# Altium schematic sheet 2_BLE.SchDoc: SmartHalo - Radio
size B; Author: Sébastien Gélinas; Organization: SmartHalo; Address1: 5445 de Gaspé; Address2: Montréal, QC; Address3: Canada; Address4: H2T 3B2; DocumentNumber: 4; Revision: 1; SheetNumber: 2; SheetTotal: 7
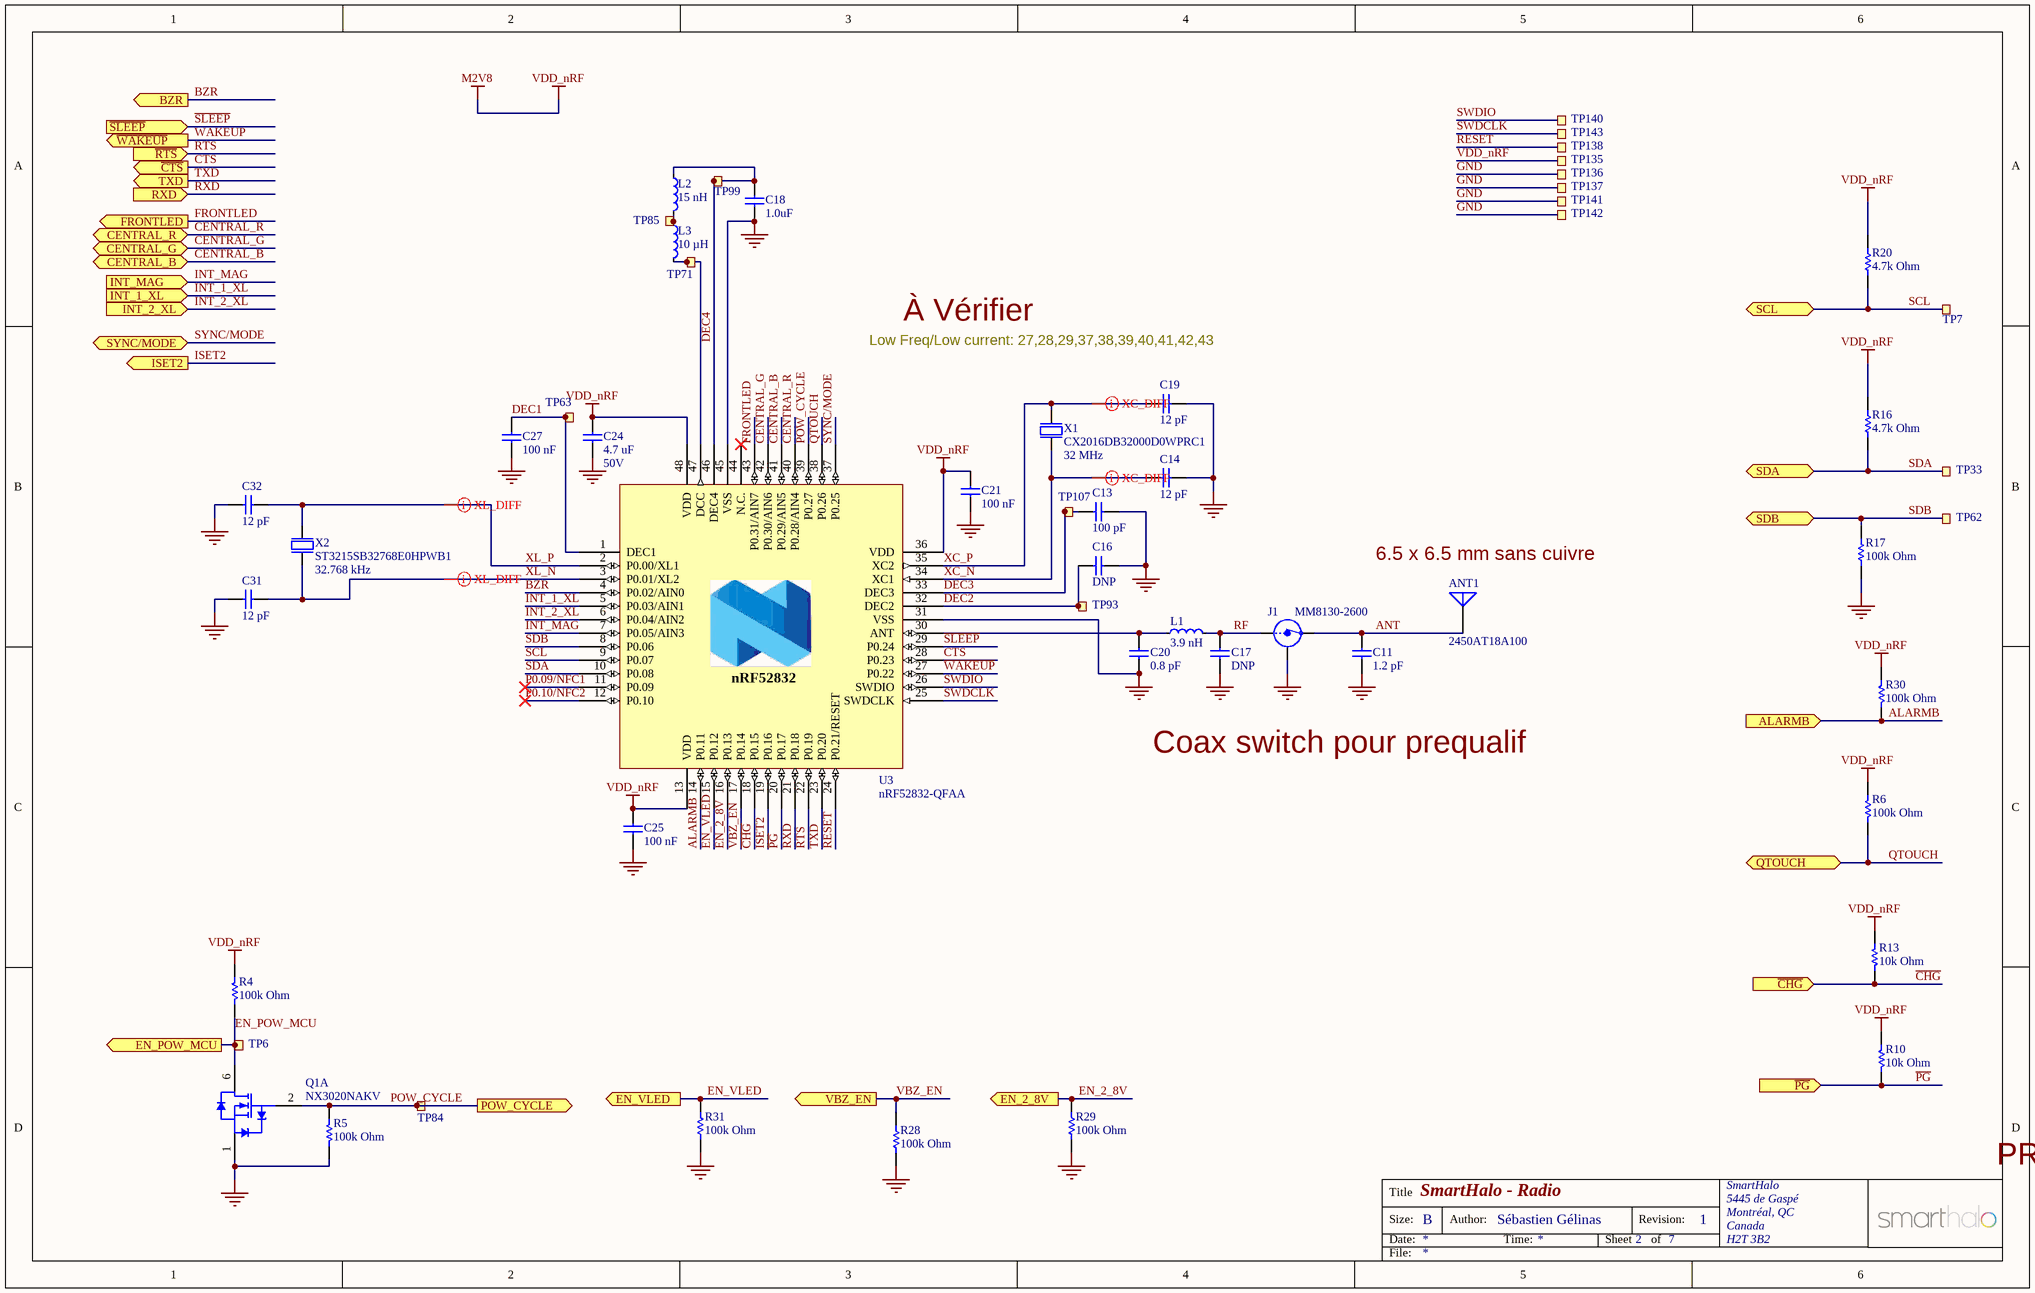
[diagram p0: 2_BLE.SchDoc]

## Parts
ANT1  2450AT18A100  [2450AT18A100]
C11  1.2 pF  [Varitron_CAP0402]
C13  100 pF  [Varitron_CAP0402]
C14  12 pF  [Varitron_CAP0402]
C16  DNP  [Varitron_CAP0402]  (no BOM)
C17  DNP  [Varitron_CAP0402]  (no BOM)
C18  1.0uF  [Varitron_CAP0603]
C19  12 pF  [Varitron_CAP0402]
C20  0.8 pF  [Varitron_CAP0402]
C21  100 nF  [Varitron_CAP0402]
C24  4.7 uF  Voltage Rating: 50V  [Varitron_CAP0805]
C25  100 nF  [Varitron_CAP0402]
C27  100 nF  [Varitron_CAP0402]
C31  12 pF  [Varitron_CAP0402]
C32  12 pF  [Varitron_CAP0402]
J1  MM8130-2600  [COAXIAL-SWF]
L1  3.9 nH  [Varitron_IND0402]
L2  15 nH  [Varitron_IND0402]
L3  10 µH  [Varitron_IND0603]
Q1  NX3020NAKV  [SOT666]  (part A of 2)
R4  100k Ohm  [Varitron_RES0402]
R5  100k Ohm  [Varitron_RES0402]
R6  100k Ohm  [Varitron_RES0402]
R10  10k Ohm  [Varitron_RES0402]
R13  10k Ohm  [Varitron_RES0402]
R16  4.7k Ohm  [Varitron_RES0402]
R17  100k Ohm  [Varitron_RES0402]
R20  4.7k Ohm  [Varitron_RES0402]
R28  100k Ohm  [Varitron_RES0402]
R29  100k Ohm  [Varitron_RES0402]
R30  100k Ohm  [Varitron_RES0402]
R31  100k Ohm  [Varitron_RES0402]
TP6  (no value)  [TESTPAD-TH-35mils]  (no BOM)
TP7  (no value)  [TESTPAD-TH-35mils]  (no BOM)
TP33  (no value)  [TESTPAD-TH-35mils]  (no BOM)
TP62  (no value)  [TESTPAD-TH-35mils]  (no BOM)
TP63  (no value)  [TESTPAD-TH-35mils]  (no BOM)
TP71  (no value)  [TESTPAD-TH-35mils]  (no BOM)
TP84  (no value)  [TESTPAD-TH-35mils]  (no BOM)
TP85  (no value)  [TESTPAD-TH-35mils]  (no BOM)
TP93  (no value)  [TESTPAD-TH-35mils]  (no BOM)
TP99  (no value)  [TESTPAD-TH-35mils]  (no BOM)
TP107  (no value)  [TESTPAD-TH-35mils]  (no BOM)
TP135  (no value)  [TESTPAD-TH-1_5mm]  (no BOM)
TP136  (no value)  [TESTPAD-TH-1_5mm]  (no BOM)
TP137  (no value)  [TESTPAD-TH-1_5mm]  (no BOM)
TP138  (no value)  [TESTPAD-TH-1_5mm]  (no BOM)
TP140  (no value)  [TESTPAD-TH-1_5mm]  (no BOM)
TP141  (no value)  [TESTPAD-TH-1_5mm]  (no BOM)
TP142  (no value)  [TESTPAD-TH-1_5mm]  (no BOM)
TP143  (no value)  [TESTPAD-TH-1_5mm]  (no BOM)
U3  nRF52832-QFAA  [QFN40P600X600X90-48N]
X1  CX2016DB32000D0WPRC1  Frequency: 32 MHz  [CRYSTAL_2016_4Pins]
X2  ST3215SB32768E0HPWB1  Frequency: 32.768 kHz  [CRYSTAL_3215_2Pins]

## Ports
ALARMB (in), BZR (out), CENTRAL_B, CENTRAL_G, CENTRAL_R, EN_2_8V (out), EN_POW_MCU (out), EN_VLED (out), FRONTLED (out), INT_1_XL (in), INT_2_XL (in), INT_MAG (in), ISET2 (out), POW_CYCLE (out), QTOUCH, RXD (in), SCL (bidir), SDA (bidir), SDB (bidir), SYNC/MODE, TXD (out), VBZ_EN (out), ~{CHG} (in), ~{CTS} (out), ~{PG} (in), ~{RTS} (in), ~{SLEEP} (in), ~{WAKEUP} (out)

## Nets
GND: C11.1 C13.2 C14.2 C16.2 C17.1 C18.2 C19.2 C20.1 C21.2 C24.2 C25.2 C27.2 C31.1 C32.1 J1.2(Shield) Q1.1(S1) R5.1 R17.1 R28.2 R29.1 R31.1 TP136.1 TP137.1 TP141.1 TP142.1 U3.31(VSS) U3.45(VSS) U3.49(GND) X1.2(GND) X1.4(GND)
VDD_nRF: C21.1 C24.1 C25.1 R4.2 R6.2 R10.2 R13.1 R16.2 R20.2 R30.2 TP135.1 U3.13(VDD) U3.36(VDD) U3.48(VDD)  [also labelled M2V8]
ALARMB: R30.1 U3.14(P0.11) ; port ALARMB
ANT: ANT1.1(Feed) C11.2 J1.3(OUT)
BZR: U3.4(P0.02/AIN0) ; port BZR
~{CHG}: R13.2 U3.18(P0.15) ; port ~{CHG}
CENTRAL_B: U3.41(P0.29/AIN5) ; port CENTRAL_B
CENTRAL_G: U3.42(P0.30/AIN6) ; port CENTRAL_G
CENTRAL_R: U3.40(P0.28/AIN4) ; port CENTRAL_R
CTS: U3.28(P0.23) ; port ~{CTS}
DEC1: C27.1 TP63.1 U3.1(DEC1)
DEC2: C16.1 TP93.1 U3.32(DEC2)
DEC3: C13.1 TP107.1 U3.33(DEC3)
DEC4: C18.1 L2.1 TP99.1 U3.46(DEC4)
EN_2_8V: R29.2 U3.16(P0.13) ; port EN_2_8V
EN_POW_MCU: Q1.6(D1) R4.1 TP6.1 ; port EN_POW_MCU
EN_VLED: R31.2 U3.15(P0.12) ; port EN_VLED
FRONTLED: U3.43(P0.31/AIN7) ; port FRONTLED
INT_1_XL: U3.5(P0.03/AIN1) ; port INT_1_XL
INT_2_XL: U3.6(P0.04/AIN2) ; port INT_2_XL
INT_MAG: U3.7(P0.05/AIN3) ; port INT_MAG
ISET2: U3.19(P0.16) ; port ISET2
P0.09/NFC1: U3.11(P0.09)
P0.10/NFC2: U3.12(P0.10)
~{PG}: R10.1 U3.20(P0.17) ; port ~{PG}
POW_CYCLE: Q1.2(G1) R5.2 TP84.1 U3.39(P0.27) ; port POW_CYCLE
QTOUCH: R6.1 U3.38(P0.26) ; port QTOUCH
RESET: TP138.1 U3.24(P0.21/RESET)
RF: C17.2 J1.1(IN) L1.2
RTS: U3.22(P0.19) ; port ~{RTS}
RXD: U3.21(P0.18) ; port RXD
~{SLEEP}: U3.29(P0.24) ; port ~{SLEEP}
SCL: R20.1 TP7.1 U3.9(P0.07) ; port SCL
SDA: R16.1 TP33.1 U3.10(P0.08) ; port SDA
SDB: R17.2 TP62.1 U3.8(P0.06) ; port SDB
SWDCLK: TP143.1 U3.25(SWDCLK)
SWDIO: TP140.1 U3.26(SWDIO)
SYNC/MODE: U3.37(P0.25) ; port SYNC/MODE
TXD: U3.23(P0.20) ; port TXD
VBZ_EN: R28.1 U3.17(P0.14) ; port VBZ_EN
~{WAKEUP}: U3.27(P0.22) ; port ~{WAKEUP}
XC_N: C14.1 U3.34(XC1) X1.3(out)
XC_P: C19.1 U3.35(XC2) X1.1(inp)
XL_N: C31.2 U3.3(P0.01/XL2) X2.2
XL_P: C32.2 U3.2(P0.00/XL1) X2.1
NetC20_2: C20.2 L1.1 U3.30(ANT)
NetL2_2: L2.2 L3.1 TP85.1
NetL3_2: L3.2 TP71.1 U3.47(DCC)

Not connected (* = marked no-connect by the designer): U3 44(N.C.)*

## Layout directives
differential pair: XC_N, XC_P, XL_N, XL_P

## Notes on the sheet
- Low Freq/Low current: 27,28,29,37,38,39,40,41,42,43
- À Vérifier
- (near ANT1) 6.5 x 6.5 mm sans cuivre
- Coax switch pour prequalif
- PRELIMINARY: DO NOT USE FOR PRODUCTION
- Title
- Size:
- Date:
- B
- Author:
- Time:
- Sheet
- Revision:
- of
- File:
- (in symbol nRF52832-QFAA) nRF52832

## Library data of the parts
ANT1 = 2450AT18A100: CHIP ANTENNA, 2.45GHz, 3.2 x 1.6 x 1.3 mm body; Manufacturer: Johanson Technology; Part Number: 2450AT18A100; Manufacturer Part Number: 2450AT18A100
C11 = Varitron_CAP0402: 1.2 pF 50V NP0 ±0.1 pF 0402 (1005 Metric)  SMD; Case-EIA: 0402; Case-Metric: 1005; Tolerance: ±0.1 pF; Technology: SMT; Temperature Coefficient: NP0; Voltage Rating: 50V; Value: 1.2 pF
C13 = Varitron_CAP0402: 100 pF 50V NP0 5% 0402 (1005 Metric)  SMD; Case-EIA: 0402; Case-Metric: 1005; Tolerance: 5%; Technology: SMT; Temperature Coefficient: NP0; Voltage Rating: 50V; Value: 100 pF
C14 C19 C31 C32 = Varitron_CAP0402: 12 pF 50V NP0 2% 0402 (1005 Metric)  SMD; Case-EIA: 0402; Case-Metric: 1005; Tolerance: 2%; Technology: SMT; Temperature Coefficient: NP0; Voltage Rating: 50V; Value: 12 pF
C16 C17 = Varitron_CAP0402: C pF V TEMP TOL% 0402 (1005 Metric)  SMD; Case-EIA: 0402; Case-Metric: 1005; Tolerance: TOL; Value: C pF; Technology: SMT; Voltage Rating: V
C18 = Varitron_CAP0603: 1uF 16V X7R 10% 0603 (1608 Metric)  SMD; Case-EIA: 0603; Case-Metric: 1608; Tolerance: 10%; Technology: SMT; Temperature Coefficient: X7R; Voltage Rating: 16V; Value: 1.0uF
C20 = Varitron_CAP0402: 0.8 pF 50V NP0 5% 0402 (1005 Metric)  SMD; Case-EIA: 0402; Case-Metric: 1005; Tolerance: 5%; Technology: SMT; Temperature Coefficient: NP0; Voltage Rating: 50V; Value: 0.8 pF
C21 C25 C27 = Varitron_CAP0402: 100 nF 16V X7R 10% 0402 (1005 Metric)  SMD; Case-EIA: 0402; Case-Metric: 1005; Tolerance: 10%; Technology: SMT; Temperature Coefficient: X7R; Voltage Rating: 16V; Value: 100 nF
C24 = Varitron_CAP0805: 4.7 uF 50V X5R 10% 0805 (2012 Metric)  SMD; Case-EIA: 0805; Case-Metric: 2012; Tolerance: 10%; Technology: SMT; Temperature Coefficient: X5R; Value: 4.7 uF
J1 = MM8130-2600: Coaxial Connector with Switch; Manufacturer: Murata; 2nd source part number: 81-MM8130-2600RA2; Artikkelnr Noca: 55029011; Artikkelnr Simpro: N.A.; Part Number: MM8130-2600; Manufacturer Part Number: MM8130-2600; Datasheet: http://www.murata.com/products/catalog/pdf/o33e.pdf; LatestRevisionDate: 2014-04-24; Pin Count: 3; Publisher: Nordic Semiconductor; Published: 2014-04-24; Value: MM8130-2600; Note: *; Supplier: Digi-Key; Supplier part number: 490-4981-1-ND; 2nd source Supplier: Mouser; Footprint Doc: COAXIAL-SWF
L1 = Varitron_IND0402: 3.9 nH ±0.1 nH, 170 mA, 0402 (1005 Metric)  SMD; Manufacturer: Murata; Manufacturer Part Number: LQP15MN3N9B02D; Case-EIA: 0402; Case-Metric: 1005; Tolerance: ±0.1 nH; SRF: MHz; DCR: Ohm; Technology: SMT; Part Number: LQP15MN3N9B02D; Value: 3.9 nH
L2 = Varitron_IND0402: 15 nH 5%, 320 mA, 0402 (1005 Metric)  SMD; Manufacturer: Taiyo Yuden; Manufacturer Part Number: HK100515NJ-T; Case-EIA: 0402; Case-Metric: 1005; SRF: MHz; DCR: Ohm; Tolerance: 5%; Technology: SMT; Part Number: HK100515NJ-T; Value: 15 nH
L3 = Varitron_IND0603: 10 µH 10%, 80 mA, 0603 (1608 Metric)  SMD; Manufacturer: Taiyo Yuden; Manufacturer Part Number: LBMF1608T100K; Case-EIA: 0603; Case-Metric: 1608; SRF: MHz; DCR: Ohm; Tolerance: 10%; Technology: SMT; Part Number: LBMF1608T100K; Value: 10 µH
Q1 = NX3020NAKV: 30 V, 200 mA dual N-channel Trench MOSFET; Manufacturer: NXP Semiconductors; Manufacturer Part Number: NX3020NAKV; Part Number: NX3020NAKV
R4-R6 R17 R28-R31 = Varitron_RES0402: 100K 0.063W 5% 0402 (1005 Metric)  SMD; Case-Metric: 1005; Case-EIA: 0402; Tolerance: 5%; Technology: SMT; Power: 0.063W; Value: 100k Ohm
R10 R13 = Varitron_RES0402: 10K 0.063W 5% 0402 (1005 Metric)  SMD; Case-Metric: 1005; Case-EIA: 0402; Tolerance: 5%; Technology: SMT; Power: 0.063W; Value: 10k Ohm
R16 R20 = Varitron_RES0402: 4K7 0.063W 5%  0402 (1005 Metric)  SMD; Case-Metric: 1005; Case-EIA: 0402; Tolerance: 5%; Technology: SMT; Power: 0.063W; Value: 4.7k Ohm
TP6 TP7 TP33 TP62 TP63 TP71 TP84 TP85 TP93 TP99 TP107 = TESTPAD_TH_35mils: Testpoint, through hole, 35 mils; Value: TP
TP135-TP138 TP140-TP143 = TESTPAD_TH_1_5MM: Testpoint, through hole, 1.5mm; Value: TP
U3 = nRF52832-QFAA: Multi-protocol Bluetooth Low Energy and 2.4GHz proprietary system-on-chip; Manufacturer: Nordic Semiconductor; Artikkelnr Noca: N.A.; Part Number: nRF52832-QFAA; Manufacturer Part Number: nRF52832-QFAA; Datasheet: *; LatestRevisionDate: 2014-11-26; Pin Count: 48; Publisher: Nordic Semiconductor; Published: 2014-11-26; Value: nRF52832-QFAA; Note: *; Supplier: Nordic Semiconductor; Supplier part number: *; 2nd source Supplier: *; 2nd source part number: *; Footprint Doc: QFN-48; Artikkelnr Simpro: N.A.
X1 = CX2016DB32000D0WPRC1: XTAL 32 MHz, 8pF, 3.2 x 1.5 mm, ±20 ppm Tol, ±200 ppm Drift; Manufacturer: AVX/Kyocera; Frequency Drift: ±40 ppm; Manufacturer Part Number: CX2016DB32000D0WPRC1; Part Number: CX2016DB32000D0WPRC1; Frequency Tolerance: ±40 ppm; Load Capacitance: 8 pF
X2 = ST3215SB32768E0HPWB1: XTAL 32.768 kHz, 9pF, 3.2 x 1.5 mm, ±20 ppm Tol, ±200 ppm Drift; Manufacturer: AVX/Kyocera; Frequency Tolerance: ±20 ppm; Frequency Drift: ±200 ppm; Manufacturer Part Number: ST3215SB32768E0HPWB1; Part Number: ST3215SB32768E0HPWB1; Load Capacitance: 9 pF